# EAGLE schematic ECG (EAGLE 7.4.0)
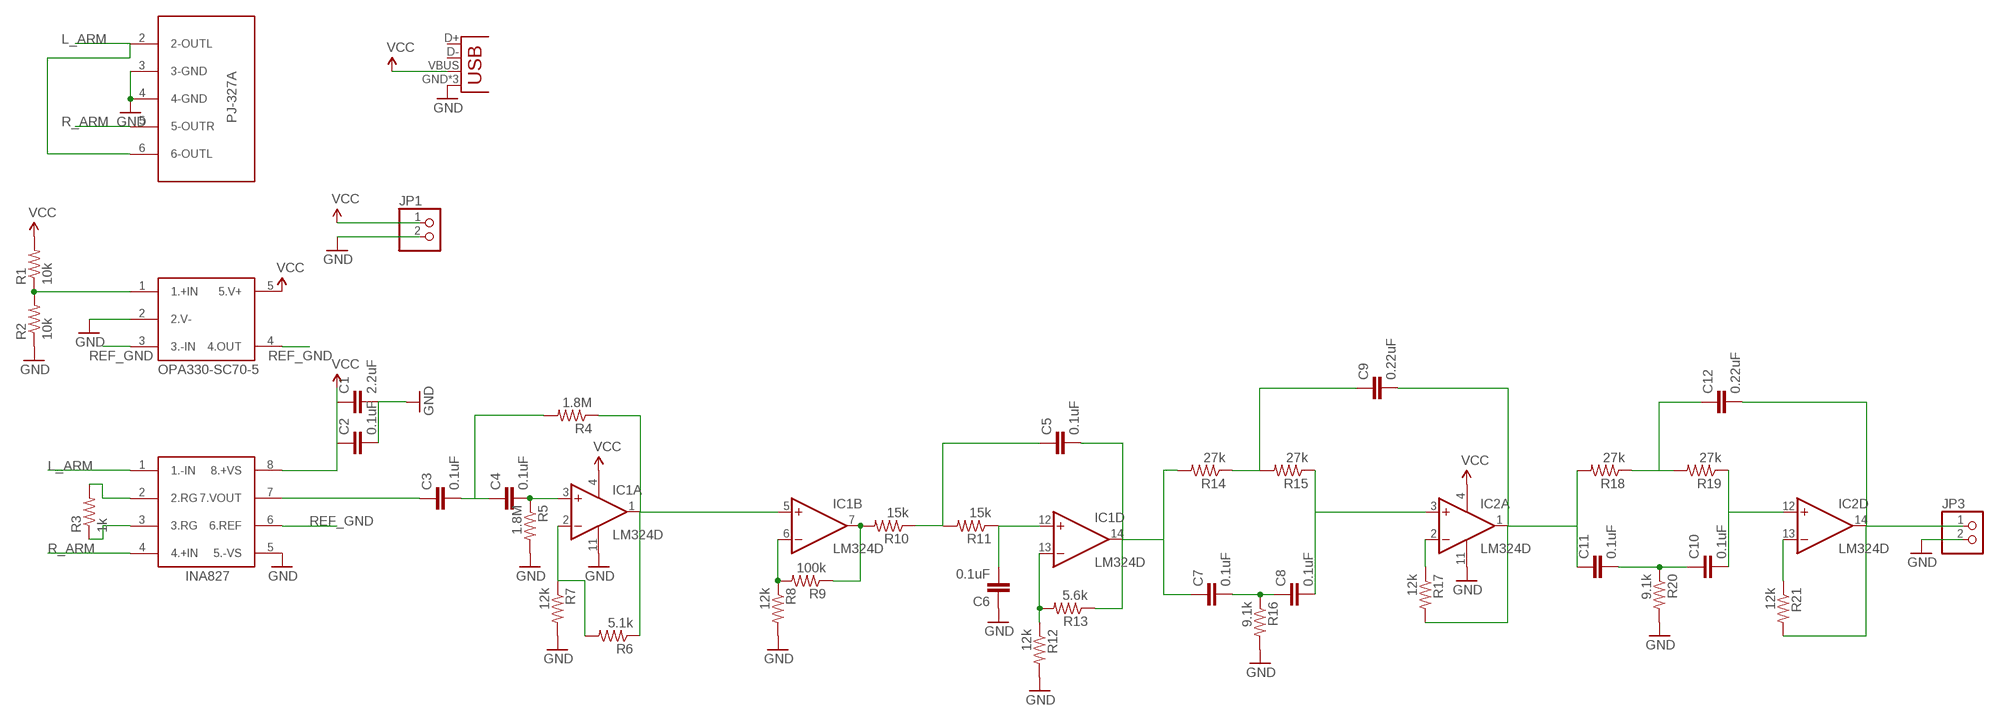
[diagram p0: schematic, sheet 1]

## Parts
C1  2.2uF  CAPPTH3  [CAP-PTH-LARGE]
C2  0.1uF  CAPPTH3  [CAP-PTH-LARGE]
C3  0.1uF  CAPPTH3  [CAP-PTH-LARGE]
C4  0.1uF  CAPPTH3  [CAP-PTH-LARGE]
C5  0.1uF  CAPPTH3  [CAP-PTH-LARGE]
C6  0.1uF  CAPPTH3  [CAP-PTH-LARGE]
C7  0.1uF  CAPPTH3  [CAP-PTH-LARGE]
C8  0.1uF  CAPPTH3  [CAP-PTH-LARGE]
C9  0.22uF  CAPPTH3  [CAP-PTH-LARGE]
C10  0.1uF  CAPPTH3  [CAP-PTH-LARGE]
C11  0.1uF  CAPPTH3  [CAP-PTH-LARGE]
C12  0.22uF  CAPPTH3  [CAP-PTH-LARGE]
IC1  LM324D  [SO14]
IC2  LM324D  [SO14]
JP1  PINHD-1X2  [1X02]
JP2  USB-MICROB  [USB-MICROB]
JP3  PINHD-1X2  [1X02]
R1  10k  RESISTORPTH-1/4W  [AXIAL-0.4]
R2  10k  RESISTORPTH-1/4W  [AXIAL-0.4]
R3  1k  RESISTORPTH-1/4W  [AXIAL-0.4]
R4  1.8M  RESISTORPTH-1/4W  [AXIAL-0.4]
R5  1.8M  RESISTORPTH-1/4W  [AXIAL-0.4]
R6  5.1k  RESISTORPTH-1/4W  [AXIAL-0.4]
R7  12k  RESISTORPTH-1/4W  [AXIAL-0.4]
R8  12k  RESISTORPTH-1/4W  [AXIAL-0.4]
R9  100k  RESISTORPTH-1/4W  [AXIAL-0.4]
R10  15k  RESISTORPTH-1/4W  [AXIAL-0.4]
R11  15k  RESISTORPTH-1/4W  [AXIAL-0.4]
R12  12k  RESISTORPTH-1/4W  [AXIAL-0.4]
R13  5.6k  RESISTORPTH-1/4W  [AXIAL-0.4]
R14  27k  RESISTORPTH-1/4W  [AXIAL-0.4]
R15  27k  RESISTORPTH-1/4W  [AXIAL-0.4]
R16  9.1k  RESISTORPTH-1/4W  [AXIAL-0.4]
R17  12k  RESISTORPTH-1/4W  [AXIAL-0.4]
R18  27k  RESISTORPTH-1/4W  [AXIAL-0.4]
R19  27k  RESISTORPTH-1/4W  [AXIAL-0.4]
R20  9.1k  RESISTORPTH-1/4W  [AXIAL-0.4]
R21  12k  RESISTORPTH-1/4W  [AXIAL-0.4]
U$1  OPA330-SC70-5  [OPA330-SC70-5]
U$2  INA827  [INA827]
U$3  PJ-327A  [PJ-327A]

## Nets
GND: C1.2 C2.2 C6.1 IC1.11(P:V-) IC2.11(P:V-) JP1.2 JP2.GND JP2.MT1(GND) JP2.MT2(GND) JP3.2 R2.P$1 R5.P$2 R7.P$2 R8.P$2 R12.P$2 R16.P$2 R20.P$2 U$1.2(2.V-) U$2.5(5.-VS) U$3.3(3-GND) U$3.4(4-GND)
L_ARM: U$2.1(1.-IN) U$3.2(2-OUTL) U$3.6(6-OUTL)
N$1: R1.P$1 R2.P$2 U$1.1(1.+IN)
N$2: R3.P$2 U$2.2(2.RG)
N$3: R3.P$1 U$2.3(3.RG)
N$4: C4.2 IC1.3(A:+IN) R5.P$1
N$5: C3.1 U$2.7(7.VOUT)
N$6: C3.2 C4.1 R4.P$2
N$7: IC1.1(A:OUT) IC1.5(B:+IN) R4.P$1 R6.P$1
N$8: IC1.2(A:-IN) R6.P$2 R7.P$1
N$9: C5.1 R10.P$1 R11.P$2
N$10: IC1.6(B:-IN) R8.P$1 R9.P$2
N$11: IC1.7(B:OUT) R9.P$1 R10.P$2
N$12: C6.2 IC1.12(D:+IN) R11.P$1
N$13: C5.2 C7.1 IC1.14(D:OUT) R13.P$1 R14.P$2
N$14: IC1.13(D:-IN) R12.P$1 R13.P$2
N$15: C9.1 R14.P$1 R15.P$2
N$16: C8.2 IC2.3(A:+IN) R15.P$1
N$17: C7.2 C8.1 R16.P$1
N$18: IC2.2(A:-IN) R17.P$1
N$19: C9.2 C11.1 IC2.1(A:OUT) R17.P$2 R18.P$2
N$20: IC2.13(D:-IN) R21.P$1
N$21: C10.1 C11.2 R20.P$1
N$22: C10.2 IC2.12(D:+IN) R19.P$1
N$23: C12.1 R18.P$1 R19.P$2
N$24: C12.2 IC2.14(D:OUT) JP3.1 R21.P$2
R_ARM: U$2.4(4.+IN) U$3.5(5-OUTR)
REF_GND: U$1.3(3.-IN) U$1.4(4.OUT) U$2.6(6.REF)
VCC: C1.1 C2.1 IC1.4(P:V+) IC2.4(P:V+) JP1.1 JP2.VBUS R1.P$2 U$1.5(5.V+) U$2.8(8.+VS)
Unconnected: IC1.8(C:OUT) IC1.9(C:-IN) IC1.10(C:+IN) IC2.5(B:+IN) IC2.6(B:-IN) IC2.7(B:OUT) IC2.8(C:OUT) IC2.9(C:-IN) IC2.10(C:+IN) JP2.D+ JP2.D-

## Library data of the parts
C1-C12 = SparkFun-Capacitors:CAP: Capacitor Standard 0603 ceramic capacitor, and 0.1" leaded capacitor.
IC1 IC2 = linear:LM324: OP AMP
JP1 JP3 = pinhead:PINHD-1X2: PIN HEADER
JP2 = SparkFun-Connectors:USB: USB Connectors USB-B-PTH is fully proven SKU : PRT-00139/CONN-08278 USB-miniB is fully proven SKU : PRT-00587 USB-A-PCB is untested. USB-A-H is throughly reviewed, but untested. Spark Fun Electronics SKU : PRT-00437 USB-B-SMT is throughly reviewed, but untested. Needs silkscreen touching up. USB-A-S has not been used/tested USB-MB-H has not been used/tested USB-MICROB has been used. CONN-09505; PROD_ID: CONN-09505
R1-R21 = SparkFun-Resistors:RESISTOR: Resistor Basic schematic elements and footprints for 0603, 1206, and PTH resistors.
U$1 = OPA330:OPA330-SC70-5
U$2 = INA827:INA827
U$3 = PJ-327A:PJ-327A